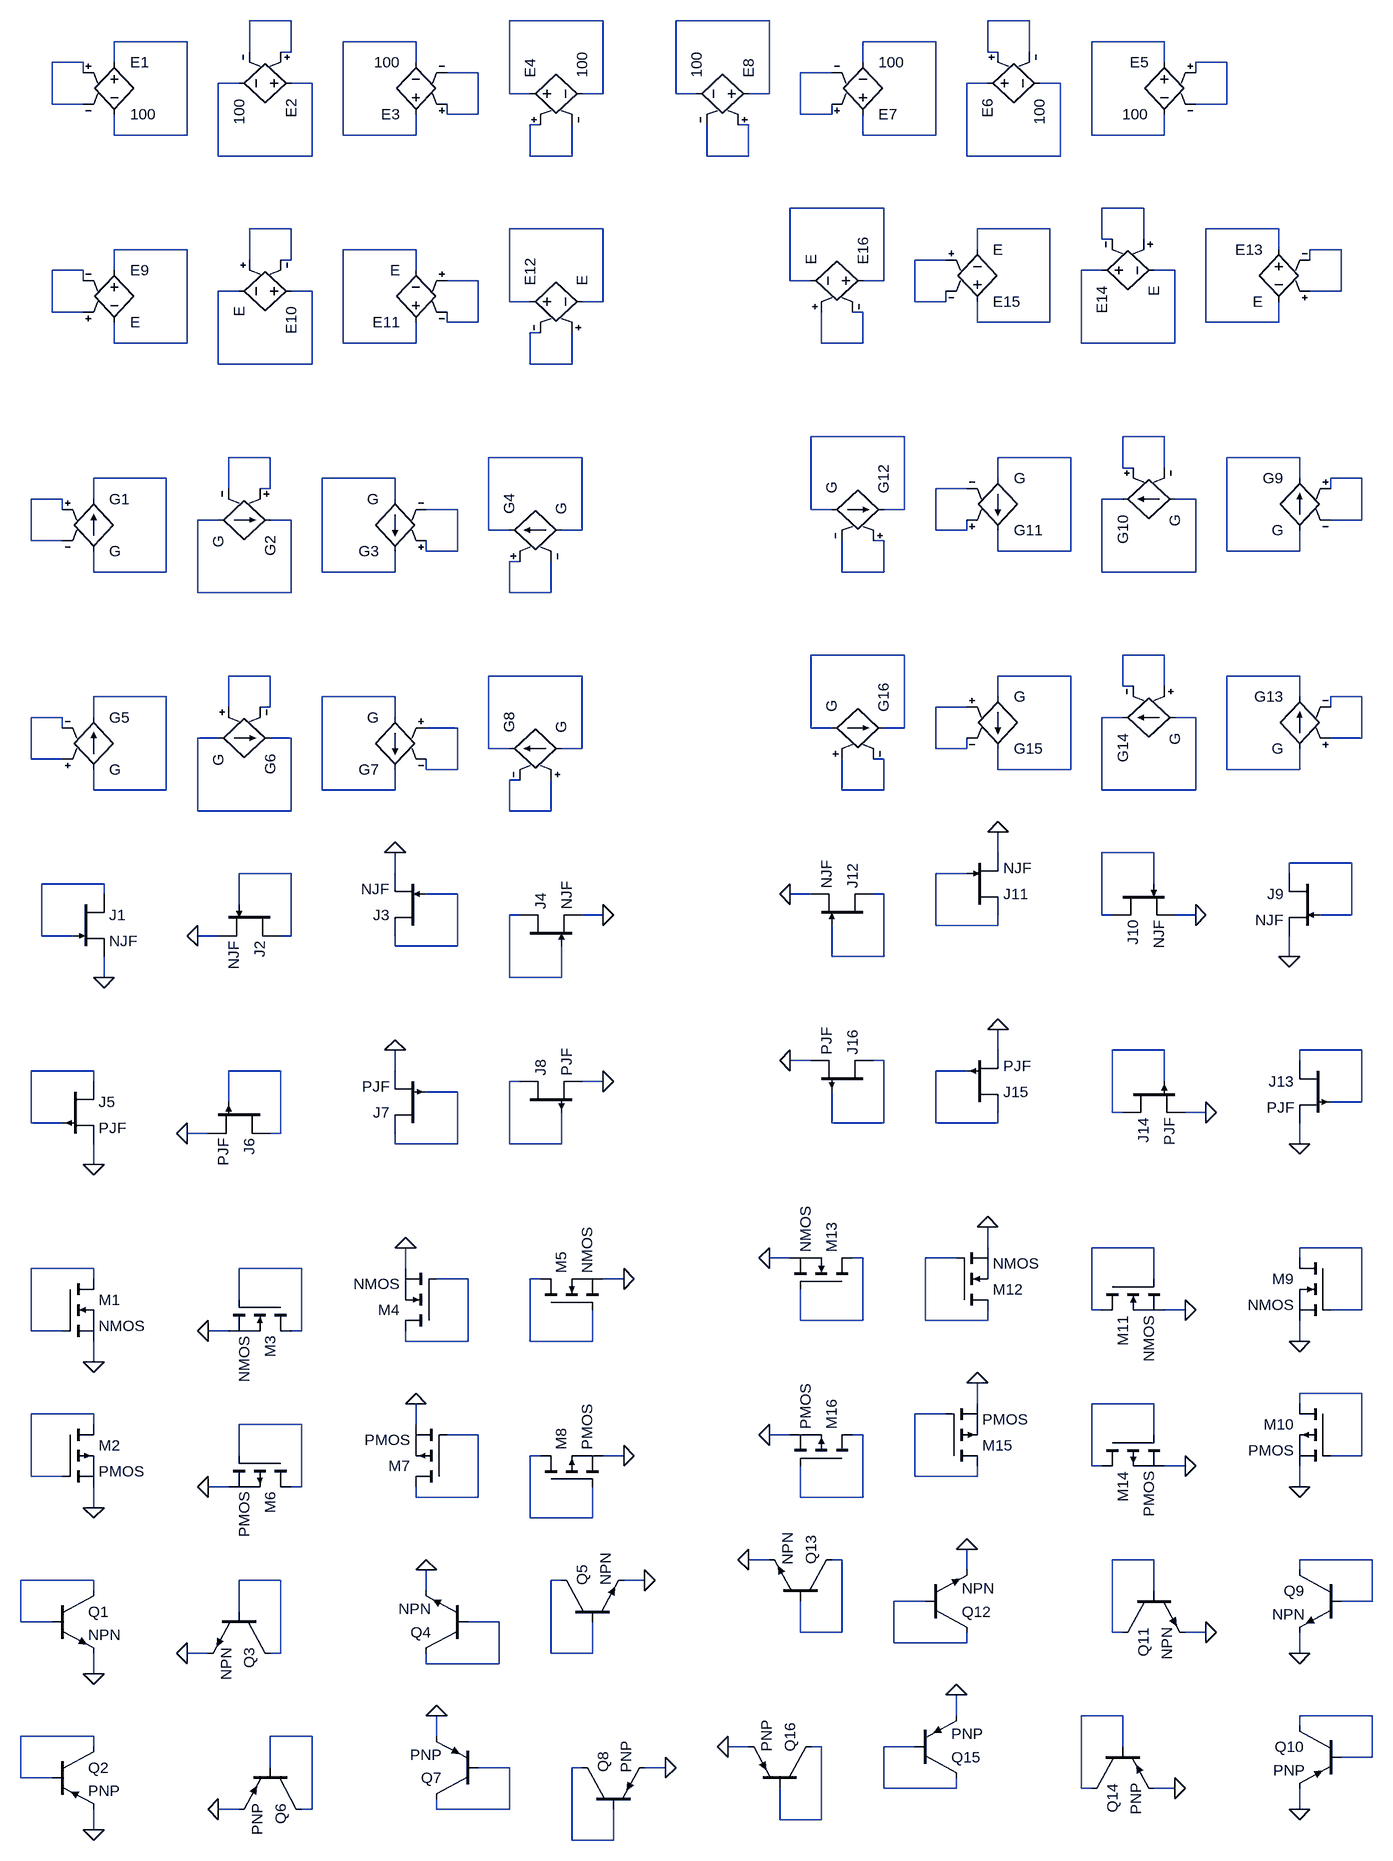
[diagram p0: schematic 07- Other components with derived rules.asc]
07- Other components with derived rules.asc, the LTspice schematic file:
Version 4.1
SHEET 1 1876 3832
WIRE 208 1008 144 1008
WIRE 688 1008 544 1008
WIRE 944 1008 800 1008
WIRE 1344 1008 1280 1008
WIRE 48 1040 -64 1040
WIRE 400 1040 288 1040
WIRE 1200 1040 1088 1040
WIRE 1552 1040 1440 1040
WIRE 144 1056 144 1008
WIRE 208 1056 208 1008
WIRE 208 1056 192 1056
WIRE 1280 1056 1280 1008
WIRE 1296 1056 1280 1056
WIRE 1344 1056 1344 1008
WIRE -112 1072 -160 1072
WIRE -64 1072 -64 1040
WIRE 400 1072 400 1040
WIRE 1088 1072 1088 1040
WIRE 1552 1072 1552 1040
WIRE 1648 1072 1600 1072
WIRE -112 1088 -112 1072
WIRE 496 1088 448 1088
WIRE 1040 1088 992 1088
WIRE 1600 1088 1600 1072
WIRE 128 1104 96 1104
WIRE 240 1104 208 1104
WIRE 1280 1104 1248 1104
WIRE 1392 1104 1360 1104
WIRE 544 1120 544 1008
WIRE 576 1120 544 1120
WIRE 688 1120 688 1008
WIRE 688 1120 656 1120
WIRE 800 1120 800 1008
WIRE 832 1120 800 1120
WIRE 944 1120 944 1008
WIRE 944 1120 912 1120
WIRE -160 1136 -160 1072
WIRE -112 1136 -160 1136
WIRE 1648 1136 1648 1072
WIRE 1648 1136 1600 1136
WIRE 448 1152 448 1136
WIRE 496 1152 496 1088
WIRE 496 1152 448 1152
WIRE 992 1152 992 1088
WIRE 1040 1152 1040 1136
WIRE 1040 1152 992 1152
WIRE 592 1168 576 1168
WIRE 912 1168 896 1168
WIRE -64 1184 -64 1152
WIRE 48 1184 48 1040
WIRE 48 1184 -64 1184
WIRE 288 1184 288 1040
WIRE 400 1184 400 1152
WIRE 400 1184 288 1184
WIRE 1088 1184 1088 1152
WIRE 1200 1184 1200 1040
WIRE 1200 1184 1088 1184
WIRE 1440 1184 1440 1040
WIRE 1552 1184 1552 1152
WIRE 1552 1184 1440 1184
WIRE 96 1216 96 1104
WIRE 240 1216 240 1104
WIRE 240 1216 96 1216
WIRE 576 1216 576 1168
WIRE 640 1216 640 1168
WIRE 640 1216 576 1216
WIRE 848 1216 848 1168
WIRE 912 1216 912 1168
WIRE 912 1216 848 1216
WIRE 1248 1216 1248 1104
WIRE 1392 1216 1392 1104
WIRE 1392 1216 1248 1216
WIRE 1120 1296 976 1296
WIRE 1520 1296 1456 1296
WIRE 208 1328 144 1328
WIRE 688 1328 544 1328
WIRE 1376 1328 1264 1328
WIRE 1728 1328 1616 1328
WIRE 1456 1344 1456 1296
WIRE 1472 1344 1456 1344
WIRE 1520 1344 1520 1296
WIRE 48 1360 -64 1360
WIRE 400 1360 288 1360
WIRE 1264 1360 1264 1328
WIRE 1728 1360 1728 1328
WIRE 1824 1360 1776 1360
WIRE 144 1376 144 1328
WIRE 208 1376 208 1328
WIRE 208 1376 192 1376
WIRE 1216 1376 1168 1376
WIRE 1776 1376 1776 1360
WIRE -112 1392 -160 1392
WIRE -64 1392 -64 1360
WIRE 400 1392 400 1360
WIRE 1456 1392 1424 1392
WIRE 1568 1392 1536 1392
WIRE -112 1408 -112 1392
WIRE 496 1408 448 1408
WIRE 976 1408 976 1296
WIRE 1008 1408 976 1408
WIRE 1120 1408 1120 1296
WIRE 1120 1408 1088 1408
WIRE 128 1424 96 1424
WIRE 240 1424 208 1424
WIRE 1824 1424 1824 1360
WIRE 1824 1424 1776 1424
WIRE 544 1440 544 1328
WIRE 576 1440 544 1440
WIRE 688 1440 688 1328
WIRE 688 1440 656 1440
WIRE 1168 1440 1168 1376
WIRE 1216 1440 1216 1424
WIRE 1216 1440 1168 1440
WIRE -160 1456 -160 1392
WIRE -112 1456 -160 1456
WIRE 1088 1456 1072 1456
WIRE 448 1472 448 1456
WIRE 496 1472 496 1408
WIRE 496 1472 448 1472
WIRE 1264 1472 1264 1440
WIRE 1376 1472 1376 1328
WIRE 1376 1472 1264 1472
WIRE 1616 1472 1616 1328
WIRE 1728 1472 1728 1440
WIRE 1728 1472 1616 1472
WIRE 592 1488 576 1488
WIRE -64 1504 -64 1472
WIRE 48 1504 48 1360
WIRE 48 1504 -64 1504
WIRE 288 1504 288 1360
WIRE 400 1504 400 1472
WIRE 400 1504 288 1504
WIRE 1024 1504 1024 1456
WIRE 1088 1504 1088 1456
WIRE 1088 1504 1024 1504
WIRE 1424 1504 1424 1392
WIRE 1568 1504 1568 1392
WIRE 1568 1504 1424 1504
WIRE 96 1536 96 1424
WIRE 240 1536 240 1424
WIRE 240 1536 96 1536
WIRE 576 1536 576 1488
WIRE 640 1536 640 1488
WIRE 640 1536 576 1536
WIRE 1152 1648 1008 1648
WIRE 1552 1648 1488 1648
WIRE 176 1680 112 1680
WIRE 656 1680 512 1680
WIRE 1408 1680 1296 1680
WIRE 1760 1680 1648 1680
WIRE 1488 1696 1488 1648
WIRE 1504 1696 1488 1696
WIRE 1552 1696 1552 1648
WIRE 16 1712 -96 1712
WIRE 368 1712 256 1712
WIRE 1296 1712 1296 1680
WIRE 1760 1712 1760 1680
WIRE 1856 1712 1808 1712
WIRE 112 1728 112 1680
WIRE 176 1728 176 1680
WIRE 176 1728 160 1728
WIRE 1248 1728 1200 1728
WIRE 1808 1728 1808 1712
WIRE -144 1744 -192 1744
WIRE -96 1744 -96 1712
WIRE 368 1744 368 1712
WIRE 1488 1744 1456 1744
WIRE 1600 1744 1568 1744
WIRE -144 1760 -144 1744
WIRE 464 1760 416 1760
WIRE 1008 1760 1008 1648
WIRE 1040 1760 1008 1760
WIRE 1152 1760 1152 1648
WIRE 1152 1760 1120 1760
WIRE 96 1776 64 1776
WIRE 208 1776 176 1776
WIRE 1856 1776 1856 1712
WIRE 1856 1776 1808 1776
WIRE 512 1792 512 1680
WIRE 544 1792 512 1792
WIRE 656 1792 656 1680
WIRE 656 1792 624 1792
WIRE 1200 1792 1200 1728
WIRE 1248 1792 1248 1776
WIRE 1248 1792 1200 1792
WIRE -192 1808 -192 1744
WIRE -144 1808 -192 1808
WIRE 1120 1808 1104 1808
WIRE 416 1824 416 1808
WIRE 464 1824 464 1760
WIRE 464 1824 416 1824
WIRE 1296 1824 1296 1792
WIRE 1408 1824 1408 1680
WIRE 1408 1824 1296 1824
WIRE 1648 1824 1648 1680
WIRE 1760 1824 1760 1792
WIRE 1760 1824 1648 1824
WIRE 560 1840 544 1840
WIRE -96 1856 -96 1824
WIRE 16 1856 16 1712
WIRE 16 1856 -96 1856
WIRE 256 1856 256 1712
WIRE 368 1856 368 1824
WIRE 368 1856 256 1856
WIRE 1056 1856 1056 1808
WIRE 1120 1856 1120 1808
WIRE 1120 1856 1056 1856
WIRE 1456 1856 1456 1744
WIRE 1600 1856 1600 1744
WIRE 1600 1856 1456 1856
WIRE 64 1888 64 1776
WIRE 208 1888 208 1776
WIRE 208 1888 64 1888
WIRE 544 1888 544 1840
WIRE 608 1888 608 1840
WIRE 608 1888 544 1888
WIRE 1152 1984 1008 1984
WIRE 1552 1984 1488 1984
WIRE 176 2016 112 2016
WIRE 656 2016 512 2016
WIRE 1408 2016 1296 2016
WIRE 1760 2016 1648 2016
WIRE 1488 2032 1488 1984
WIRE 1504 2032 1488 2032
WIRE 1552 2032 1552 1984
WIRE 16 2048 -96 2048
WIRE 368 2048 256 2048
WIRE 1296 2048 1296 2016
WIRE 1760 2048 1760 2016
WIRE 1856 2048 1808 2048
WIRE 112 2064 112 2016
WIRE 176 2064 176 2016
WIRE 176 2064 160 2064
WIRE 1248 2064 1200 2064
WIRE 1808 2064 1808 2048
WIRE -144 2080 -192 2080
WIRE -96 2080 -96 2048
WIRE 368 2080 368 2048
WIRE 1488 2080 1456 2080
WIRE 1600 2080 1568 2080
WIRE -144 2096 -144 2080
WIRE 464 2096 416 2096
WIRE 1008 2096 1008 1984
WIRE 1040 2096 1008 2096
WIRE 1152 2096 1152 1984
WIRE 1152 2096 1120 2096
WIRE 96 2112 64 2112
WIRE 208 2112 176 2112
WIRE 1856 2112 1856 2048
WIRE 1856 2112 1808 2112
WIRE 512 2128 512 2016
WIRE 544 2128 512 2128
WIRE 656 2128 656 2016
WIRE 656 2128 624 2128
WIRE 1200 2128 1200 2064
WIRE 1248 2128 1248 2112
WIRE 1248 2128 1200 2128
WIRE -192 2144 -192 2080
WIRE -144 2144 -192 2144
WIRE 1120 2144 1104 2144
WIRE 416 2160 416 2144
WIRE 464 2160 464 2096
WIRE 464 2160 416 2160
WIRE 1296 2160 1296 2128
WIRE 1408 2160 1408 2016
WIRE 1408 2160 1296 2160
WIRE 1648 2160 1648 2016
WIRE 1760 2160 1760 2128
WIRE 1760 2160 1648 2160
WIRE 560 2176 544 2176
WIRE -96 2192 -96 2160
WIRE 16 2192 16 2048
WIRE 16 2192 -96 2192
WIRE 256 2192 256 2048
WIRE 368 2192 368 2160
WIRE 368 2192 256 2192
WIRE 1056 2192 1056 2144
WIRE 1120 2192 1120 2144
WIRE 1120 2192 1056 2192
WIRE 1456 2192 1456 2080
WIRE 1600 2192 1600 2080
WIRE 1600 2192 1456 2192
WIRE 64 2224 64 2112
WIRE 208 2224 208 2112
WIRE 208 2224 64 2224
WIRE 544 2224 544 2176
WIRE 608 2224 608 2176
WIRE 608 2224 544 2224
WIRE 1296 2288 1296 2256
WIRE 1536 2288 1456 2288
WIRE 1840 2304 1744 2304
WIRE 208 2320 128 2320
WIRE 368 2320 368 2288
WIRE 1248 2320 1200 2320
WIRE 1744 2320 1744 2304
WIRE -80 2336 -176 2336
WIRE 1536 2336 1536 2288
WIRE -80 2352 -80 2336
WIRE 464 2352 416 2352
WIRE 1008 2352 976 2352
WIRE 1120 2352 1104 2352
WIRE 128 2368 128 2320
WIRE 560 2384 544 2384
WIRE 688 2384 656 2384
WIRE 1456 2384 1456 2288
WIRE 1472 2384 1456 2384
WIRE 1600 2384 1568 2384
WIRE 1840 2384 1840 2304
WIRE 1840 2384 1792 2384
WIRE 1200 2400 1200 2320
WIRE 1296 2400 1296 2384
WIRE 1296 2400 1200 2400
WIRE -176 2416 -176 2336
WIRE -128 2416 -176 2416
WIRE 96 2416 64 2416
WIRE 208 2416 208 2320
WIRE 208 2416 192 2416
WIRE 368 2432 368 2416
WIRE 464 2432 464 2352
WIRE 464 2432 368 2432
WIRE 1040 2448 1040 2400
WIRE 1120 2448 1120 2352
WIRE 1120 2448 1040 2448
WIRE 1744 2448 1744 2416
WIRE -80 2480 -80 2448
WIRE 544 2480 544 2384
WIRE 624 2480 624 2432
WIRE 624 2480 544 2480
WIRE 1296 2592 1296 2560
WIRE 1552 2592 1472 2592
WIRE 1856 2592 1760 2592
WIRE 1008 2608 976 2608
WIRE 1120 2608 1104 2608
WIRE 1760 2608 1760 2592
WIRE -96 2624 -192 2624
WIRE 192 2624 112 2624
WIRE 368 2624 368 2592
WIRE 1248 2624 1200 2624
WIRE -96 2640 -96 2624
WIRE 560 2640 544 2640
WIRE 688 2640 656 2640
WIRE 1552 2640 1552 2592
WIRE 464 2656 416 2656
WIRE 112 2672 112 2624
WIRE 1856 2672 1856 2592
WIRE 1856 2672 1808 2672
WIRE 1472 2688 1472 2592
WIRE 1488 2688 1472 2688
WIRE 1616 2688 1584 2688
WIRE -192 2704 -192 2624
WIRE -144 2704 -192 2704
WIRE 1040 2704 1040 2656
WIRE 1120 2704 1120 2608
WIRE 1120 2704 1040 2704
WIRE 1200 2704 1200 2624
WIRE 1296 2704 1296 2688
WIRE 1296 2704 1200 2704
WIRE 80 2720 48 2720
WIRE 192 2720 192 2624
WIRE 192 2720 176 2720
WIRE 368 2736 368 2720
WIRE 464 2736 464 2656
WIRE 464 2736 368 2736
WIRE 544 2736 544 2640
WIRE 624 2736 624 2688
WIRE 624 2736 544 2736
WIRE 1760 2736 1760 2704
WIRE -96 2768 -96 2736
WIRE 1280 2896 1280 2864
WIRE 1536 2896 1440 2896
WIRE 1856 2896 1760 2896
WIRE 976 2912 944 2912
WIRE 1088 2912 1072 2912
WIRE 1232 2912 1184 2912
WIRE 1760 2912 1760 2896
WIRE -96 2928 -192 2928
WIRE 224 2928 128 2928
WIRE 384 2928 384 2896
WIRE -96 2944 -96 2928
WIRE 480 2944 432 2944
WIRE 592 2944 576 2944
WIRE 720 2944 688 2944
WIRE 1536 2944 1536 2896
WIRE 128 2976 128 2928
WIRE 1440 2992 1440 2896
WIRE 1456 2992 1440 2992
WIRE 1584 2992 1552 2992
WIRE 1856 2992 1856 2896
WIRE 1856 2992 1808 2992
WIRE 992 3008 992 2960
WIRE 1088 3008 1088 2912
WIRE 1088 3008 992 3008
WIRE 1184 3008 1184 2912
WIRE 1280 3008 1280 2992
WIRE 1280 3008 1184 3008
WIRE -192 3024 -192 2928
WIRE -144 3024 -192 3024
WIRE 112 3024 80 3024
WIRE 224 3024 224 2928
WIRE 224 3024 208 3024
WIRE 384 3040 384 3024
WIRE 480 3040 480 2944
WIRE 480 3040 384 3040
WIRE 576 3040 576 2944
WIRE 672 3040 672 2992
WIRE 672 3040 576 3040
WIRE 1760 3040 1760 3008
WIRE -96 3072 -96 3040
WIRE 1856 3120 1760 3120
WIRE 1264 3136 1264 3104
WIRE 1536 3136 1440 3136
WIRE 1760 3136 1760 3120
WIRE -96 3152 -192 3152
WIRE 1216 3152 1168 3152
WIRE -96 3168 -96 3152
WIRE 224 3168 128 3168
WIRE 400 3168 400 3136
WIRE 496 3184 448 3184
WIRE 976 3184 944 3184
WIRE 1088 3184 1072 3184
WIRE 1536 3184 1536 3136
WIRE 128 3216 128 3168
WIRE 592 3216 576 3216
WIRE 720 3216 688 3216
WIRE 1856 3216 1856 3120
WIRE 1856 3216 1808 3216
WIRE 1440 3232 1440 3136
WIRE 1456 3232 1440 3232
WIRE 1584 3232 1552 3232
WIRE -192 3248 -192 3152
WIRE -144 3248 -192 3248
WIRE 1168 3248 1168 3152
WIRE 1264 3248 1264 3232
WIRE 1264 3248 1168 3248
WIRE 112 3264 80 3264
WIRE 224 3264 224 3168
WIRE 224 3264 208 3264
WIRE 1760 3264 1760 3232
WIRE 400 3280 400 3264
WIRE 496 3280 496 3184
WIRE 496 3280 400 3280
WIRE 992 3280 992 3232
WIRE 1088 3280 1088 3184
WIRE 1088 3280 992 3280
WIRE -96 3296 -96 3264
WIRE 576 3312 576 3216
WIRE 672 3312 672 3264
WIRE 672 3312 576 3312
WIRE 944 3376 912 3376
WIRE 1056 3376 1040 3376
WIRE 1536 3376 1472 3376
WIRE 1872 3376 1760 3376
WIRE 1248 3392 1248 3360
WIRE 1760 3392 1760 3376
WIRE -96 3408 -208 3408
WIRE 192 3408 128 3408
WIRE 624 3408 608 3408
WIRE 752 3408 720 3408
WIRE -96 3424 -96 3408
WIRE 416 3424 416 3392
WIRE 1536 3424 1536 3376
WIRE 1184 3440 1136 3440
WIRE 1872 3440 1872 3376
WIRE 1872 3440 1824 3440
WIRE 128 3456 128 3408
WIRE -208 3472 -208 3408
WIRE -160 3472 -208 3472
WIRE 528 3472 480 3472
WIRE 992 3488 992 3440
WIRE 1056 3488 1056 3376
WIRE 1056 3488 992 3488
WIRE 1472 3488 1472 3376
WIRE 1488 3488 1472 3488
WIRE 1616 3488 1584 3488
WIRE 1136 3504 1136 3440
WIRE 1248 3504 1248 3488
WIRE 1248 3504 1136 3504
WIRE 80 3520 48 3520
WIRE 192 3520 192 3408
WIRE 192 3520 176 3520
WIRE 608 3520 608 3408
WIRE 672 3520 672 3472
WIRE 672 3520 608 3520
WIRE 1760 3520 1760 3488
WIRE 416 3536 416 3520
WIRE 528 3536 528 3472
WIRE 528 3536 416 3536
WIRE -96 3552 -96 3520
WIRE 1232 3616 1232 3584
WIRE 1488 3616 1424 3616
WIRE 1872 3616 1760 3616
WIRE 1760 3632 1760 3616
WIRE -96 3648 -208 3648
WIRE 240 3648 176 3648
WIRE 432 3648 432 3616
WIRE -96 3664 -96 3648
WIRE 912 3664 880 3664
WIRE 1024 3664 1008 3664
WIRE 1168 3664 1120 3664
WIRE 1488 3664 1488 3616
WIRE 1872 3680 1872 3616
WIRE 1872 3680 1824 3680
WIRE 176 3696 176 3648
WIRE 544 3696 496 3696
WIRE 656 3696 640 3696
WIRE 784 3696 752 3696
WIRE -208 3712 -208 3648
WIRE -160 3712 -208 3712
WIRE 1120 3728 1120 3664
WIRE 1232 3728 1232 3712
WIRE 1232 3728 1120 3728
WIRE 1424 3728 1424 3616
WIRE 1440 3728 1424 3728
WIRE 1568 3728 1536 3728
WIRE 128 3760 96 3760
WIRE 240 3760 240 3648
WIRE 240 3760 224 3760
WIRE 432 3760 432 3744
WIRE 544 3760 544 3696
WIRE 544 3760 432 3760
WIRE 1760 3760 1760 3728
WIRE 960 3776 960 3728
WIRE 1024 3776 1024 3664
WIRE 1024 3776 960 3776
WIRE -96 3792 -96 3760
WIRE 640 3808 640 3696
WIRE 704 3808 704 3760
WIRE 704 3808 640 3808
FLAG -80 2480 0
FLAG 64 2416 0
FLAG 368 2288 0
FLAG 688 2384 0
FLAG -96 2768 0
FLAG 48 2720 0
FLAG 368 2592 0
FLAG 688 2640 0
FLAG -96 3072 0
FLAG -96 3296 0
FLAG 80 3024 0
FLAG 384 2896 0
FLAG 720 2944 0
FLAG 80 3264 0
FLAG 400 3136 0
FLAG 720 3216 0
FLAG -96 3552 0
FLAG -96 3792 0
FLAG 48 3520 0
FLAG 416 3392 0
FLAG 752 3408 0
FLAG 96 3760 0
FLAG 432 3616 0
FLAG 784 3696 0
FLAG 1744 2448 0
FLAG 1600 2384 0
FLAG 1296 2256 0
FLAG 976 2352 0
FLAG 1760 2736 0
FLAG 1616 2688 0
FLAG 1296 2560 0
FLAG 976 2608 0
FLAG 1760 3040 0
FLAG 1760 3264 0
FLAG 1584 2992 0
FLAG 1280 2864 0
FLAG 944 2912 0
FLAG 1584 3232 0
FLAG 1264 3104 0
FLAG 944 3184 0
FLAG 1760 3520 0
FLAG 1760 3760 0
FLAG 1616 3488 0
FLAG 1248 3360 0
FLAG 912 3376 0
FLAG 1568 3728 0
FLAG 1232 3584 0
FLAG 880 3664 0
SYMBOL e -64 1056 R0
SYMATTR InstName E1
SYMATTR Value 100
SYMBOL e 224 1104 R90
SYMATTR InstName E2
SYMATTR Value 100
SYMBOL e 400 1168 R180
SYMATTR InstName E3
SYMATTR Value 100
SYMBOL e 560 1120 R270
SYMATTR InstName E4
SYMATTR Value 100
SYMBOL e 1552 1056 M0
SYMATTR InstName E5
SYMATTR Value 100
SYMBOL e 1264 1104 M90
SYMATTR InstName E6
SYMATTR Value 100
SYMBOL e 1088 1168 M180
SYMATTR InstName E7
SYMATTR Value 100
SYMBOL e 928 1120 M270
SYMATTR InstName E8
SYMATTR Value 100
SYMBOL e2 -64 1376 R0
SYMATTR InstName E9
SYMBOL e2 224 1424 R90
SYMATTR InstName E10
SYMBOL e2 400 1488 R180
SYMATTR InstName E11
SYMBOL e2 560 1440 R270
SYMATTR InstName E12
SYMBOL g -96 1728 R0
SYMATTR InstName G1
SYMBOL g 192 1776 R90
SYMATTR InstName G2
SYMBOL g 368 1840 R180
SYMATTR InstName G3
SYMBOL g 528 1792 R270
SYMATTR InstName G4
SYMBOL g2 -96 2064 R0
SYMATTR InstName G5
SYMBOL g2 192 2112 R90
SYMATTR InstName G6
SYMBOL g2 368 2176 R180
SYMATTR InstName G7
SYMBOL g2 528 2128 R270
SYMATTR InstName G8
SYMBOL njf -128 2352 R0
SYMATTR InstName J1
SYMBOL njf 192 2368 R90
SYMATTR InstName J2
SYMBOL njf 416 2416 R180
SYMATTR InstName J3
SYMBOL njf 560 2432 R270
SYMATTR InstName J4
SYMBOL pjf -144 2640 R0
SYMATTR InstName J5
SYMBOL pjf 176 2672 R90
SYMATTR InstName J6
SYMBOL pjf 416 2720 R180
SYMATTR InstName J7
SYMBOL pjf 560 2688 R270
SYMATTR InstName J8
SYMBOL nmos -144 2944 R0
SYMATTR InstName M1
SYMBOL pmos -144 3168 R0
SYMATTR InstName M2
SYMBOL nmos 208 2976 R90
SYMATTR InstName M3
SYMBOL nmos 432 3024 R180
SYMATTR InstName M4
SYMBOL nmos 592 2992 R270
SYMATTR InstName M5
SYMBOL pmos 208 3216 R90
SYMATTR InstName M6
SYMBOL pmos 448 3264 R180
SYMATTR InstName M7
SYMBOL pmos 592 3264 R270
SYMATTR InstName M8
SYMBOL npn -160 3424 R0
SYMATTR InstName Q1
SYMBOL pnp -160 3664 R0
SYMATTR InstName Q2
SYMBOL npn 176 3456 R90
SYMATTR InstName Q3
SYMBOL npn 480 3520 R180
SYMATTR InstName Q4
SYMBOL npn 624 3472 R270
SYMATTR InstName Q5
SYMBOL pnp 224 3696 R90
SYMATTR InstName Q6
SYMBOL pnp 496 3744 R180
SYMATTR InstName Q7
SYMBOL pnp 656 3760 R270
SYMATTR InstName Q8
SYMBOL e2 1728 1344 M0
SYMATTR InstName E13
SYMBOL e2 1440 1392 M90
SYMATTR InstName E14
SYMBOL e2 1264 1456 M180
SYMATTR InstName E15
SYMBOL e2 1104 1408 M270
SYMATTR InstName E16
SYMBOL g 1760 1696 M0
SYMATTR InstName G9
SYMBOL g 1472 1744 M90
SYMATTR InstName G10
SYMBOL g 1296 1808 M180
SYMATTR InstName G11
SYMBOL g 1136 1760 M270
SYMATTR InstName G12
SYMBOL g2 1760 2032 M0
SYMATTR InstName G13
SYMBOL g2 1472 2080 M90
SYMATTR InstName G14
SYMBOL g2 1296 2144 M180
SYMATTR InstName G15
SYMBOL g2 1136 2096 M270
SYMATTR InstName G16
SYMBOL njf 1792 2320 M0
SYMATTR InstName J9
SYMBOL njf 1472 2336 M90
SYMATTR InstName J10
SYMBOL njf 1248 2384 M180
SYMATTR InstName J11
SYMBOL njf 1104 2400 M270
SYMATTR InstName J12
SYMBOL pjf 1808 2608 M0
SYMATTR InstName J13
SYMBOL pjf 1488 2640 M90
SYMATTR InstName J14
SYMBOL pjf 1248 2688 M180
SYMATTR InstName J15
SYMBOL pjf 1104 2656 M270
SYMATTR InstName J16
SYMBOL nmos 1808 2912 M0
SYMATTR InstName M9
SYMBOL pmos 1808 3136 M0
SYMATTR InstName M10
SYMBOL nmos 1456 2944 M90
SYMATTR InstName M11
SYMBOL nmos 1232 2992 M180
SYMATTR InstName M12
SYMBOL nmos 1072 2960 M270
SYMATTR InstName M13
SYMBOL pmos 1456 3184 M90
SYMATTR InstName M14
SYMBOL pmos 1216 3232 M180
SYMATTR InstName M15
SYMBOL pmos 1072 3232 M270
SYMATTR InstName M16
SYMBOL npn 1824 3392 M0
SYMATTR InstName Q9
SYMBOL pnp 1824 3632 M0
SYMATTR InstName Q10
SYMBOL npn 1488 3424 M90
SYMATTR InstName Q11
SYMBOL npn 1184 3488 M180
SYMATTR InstName Q12
SYMBOL npn 1040 3440 M270
SYMATTR InstName Q13
SYMBOL pnp 1440 3664 M90
SYMATTR InstName Q14
SYMBOL pnp 1168 3712 M180
SYMATTR InstName Q15
SYMBOL pnp 1008 3728 M270
SYMATTR InstName Q16

The netlist it stands for:
* 07- Other components with derived rules.asc
E1 N005 N005 N009 N009 100
E2 N013 N013 N001 N001 100
E3 N006 N006 N011 N011 100
E4 N002 N002 N015 N015 100
E5 N008 N008 N010 N010 100
E6 N014 N014 N004 N004 100
E7 N007 N007 N012 N012 100
E8 N003 N003 N016 N016 100
E9 N023 N023 N027 N027 E
E10 N030 N030 N019 N019 E
E11 N024 N024 N029 N029 E
E12 N020 N020 N032 N032 E
G1 N039 N039 N043 N043 G
G2 N046 N046 N035 N035 G
G3 N040 N040 N045 N045 G
G4 N036 N036 N048 N048 G
G5 N055 N055 N059 N059 G
G6 N062 N062 N051 N051 G
G7 N056 N056 N061 N061 G
G8 N052 N052 N064 N064 G
J1 N069 N069 0 NJF
J2 N067 N067 0 NJF
J3 N070 N070 0 NJF
J4 N072 N072 0 NJF
J5 N076 N076 0 PJF
J6 N077 N077 0 PJF
J7 N080 N080 0 PJF
J8 N079 N079 0 PJF
M1 N085 N085 0 0 NMOS
M2 N091 N091 0 0 PMOS
M3 N086 N086 0 0 NMOS
M4 N087 N087 0 0 NMOS
M5 N088 N088 0 0 NMOS
M6 N093 N093 0 0 PMOS
M7 N094 N094 0 0 PMOS
M8 N096 N096 0 0 PMOS
Q1 N100 N100 0 0 NPN
Q2 N107 N107 0 0 PNP
Q3 N101 N101 0 0 NPN
Q4 N104 N104 0 0 NPN
Q5 N102 N102 0 0 NPN
Q6 N108 N108 0 0 PNP
Q7 N111 N111 0 0 PNP
Q8 N112 N112 0 0 PNP
E13 N022 N022 N025 N025 E
E14 N028 N028 N018 N018 E
E15 N021 N021 N026 N026 E
E16 N017 N017 N031 N031 E
G9 N038 N038 N041 N041 G
G10 N044 N044 N034 N034 G
G11 N037 N037 N042 N042 G
G12 N033 N033 N047 N047 G
G13 N054 N054 N057 N057 G
G14 N060 N060 N050 N050 G
G15 N053 N053 N058 N058 G
G16 N049 N049 N063 N063 G
J9 N066 N066 0 NJF
J10 N065 N065 0 NJF
J11 N068 N068 0 NJF
J12 N071 N071 0 NJF
J13 N074 N074 0 PJF
J14 N073 N073 0 PJF
J15 N078 N078 0 PJF
J16 N075 N075 0 PJF
M9 N082 N082 0 0 NMOS
M10 N089 N089 0 0 PMOS
M11 N081 N081 0 0 NMOS
M12 N084 N084 0 0 NMOS
M13 N083 N083 0 0 NMOS
M14 N090 N090 0 0 PMOS
M15 N092 N092 0 0 PMOS
M16 N095 N095 0 0 PMOS
Q9 N099 N099 0 0 NPN
Q10 N106 N106 0 0 PNP
Q11 N098 N098 0 0 NPN
Q12 N103 N103 0 0 NPN
Q13 N097 N097 0 0 NPN
Q14 N105 N105 0 0 PNP
Q15 N110 N110 0 0 PNP
Q16 N109 N109 0 0 PNP
.model NPN NPN
.model PNP PNP
.lib standard.bjt
.model NJF NJF
.model PJF PJF
.lib standard.jft
.model NMOS NMOS
.model PMOS PMOS
.lib standard.mos
.backanno
.end